# EAGLE design driver (EAGLE 8.1.0)
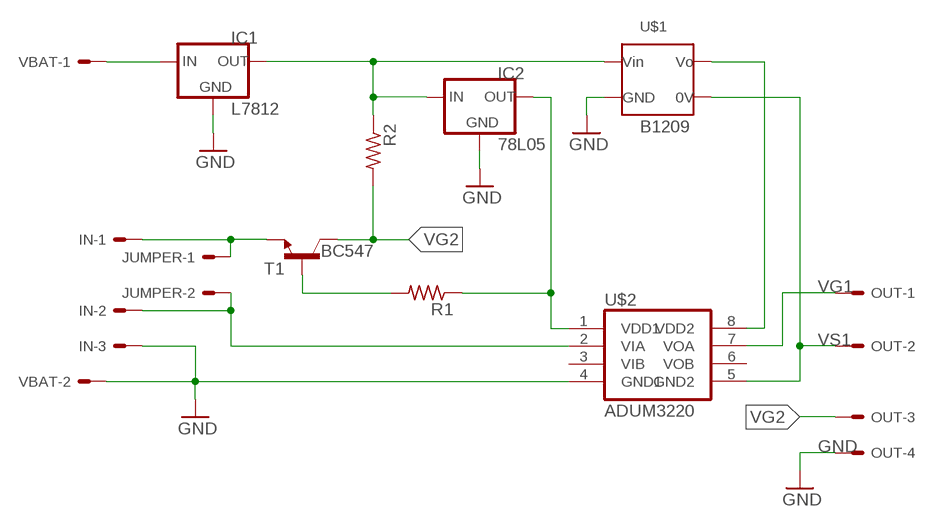
[diagram p0: schematic, sheet 1]

## Parts
IC1  L7812  78XXL  [78XXL]
IC2  78L05  78LXX  [78LXX]
IN  22-23-2031  [22-23-2031]
JUMPER  22-23-2021  [22-23-2021]
OUT  22-23-2041  [22-23-2041]
R1  R-US_0204/7  [0204/7]
R2  R-US_0204/7  [0204/7]
T1  BC547  [TO92]
U$1  B1209  [22-23-2041]
U$2  ADUM3220  [SO8]
VBAT  22-23-2021  [22-23-2021]

## Nets
GND: IC1.GND IC2.GND IN.3 OUT.4 U$1.1(GND) U$2.4(GND1) VBAT.2
N$1: IC1.OUT IC2.IN R2.1 U$1.2(VIN)
N$2: IC2.OUT R1.1 U$2.1(VDD1)
N$4: R1.2 T1.2(B)
N$5: IC1.IN VBAT.1
N$6: IN.2 JUMPER.2 U$2.2(VIA)
N$7: IN.1 JUMPER.1 T1.1(E)
VDD2: U$1.4(VO) U$2.8(VDD2)
VG1: OUT.1 U$2.7(VOA)
VG2: OUT.3 R2.2 T1.3(C)
VS1: OUT.2 U$1.3(0V) U$2.5(GND2)
Unconnected: U$2.3(VIB) U$2.6(VOB)

## Library data of the parts
IC1 = v-reg:78XXL: VOLTAGE REGULATOR
IC2 = v-reg:78LXX: VOLTAGE REGULATOR
IN = con-molex:22-23-2031: .100" (2.54mm) Center Header - 3 Pin; MF: MOLEX; MPN: 22-23-2031; OC_FARNELL: 1462950; OC_NEWARK: 30C0862
JUMPER VBAT = con-molex:22-23-2021: .100" (2.54mm) Center Header - 2 Pin; MF: MOLEX; MPN: 22-23-2021; OC_FARNELL: 1462926; OC_NEWARK: 25C3832
OUT = con-molex:22-23-2041: .100" (2.54mm) Center Header - 4 Pin; MF: MOLEX; MPN: 22-23-2041; OC_FARNELL: 1462920; OC_NEWARK: 38C0355
R1 R2 = resistor:R-US_: RESISTOR, American symbol
T1 = transistor:BC547: NPN TRANSISTOR
U$1 = felippe:B1209
U$2 = felippe:ADUM3220

## Board
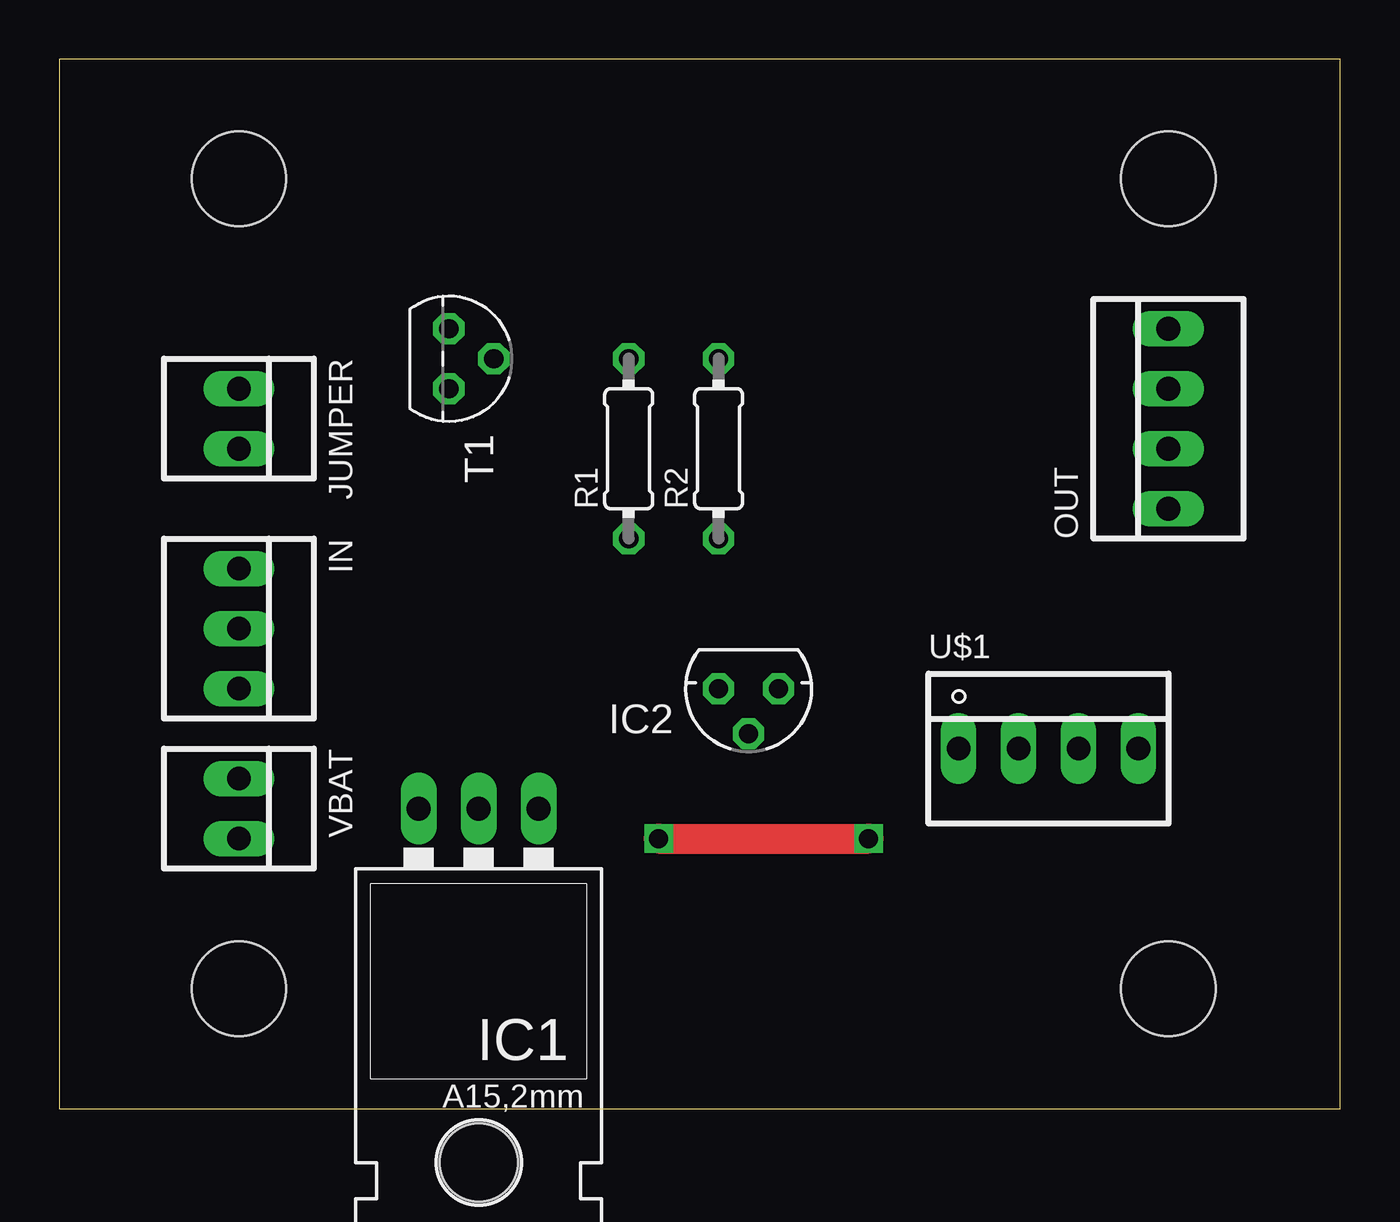
[diagram p1: board, top side]
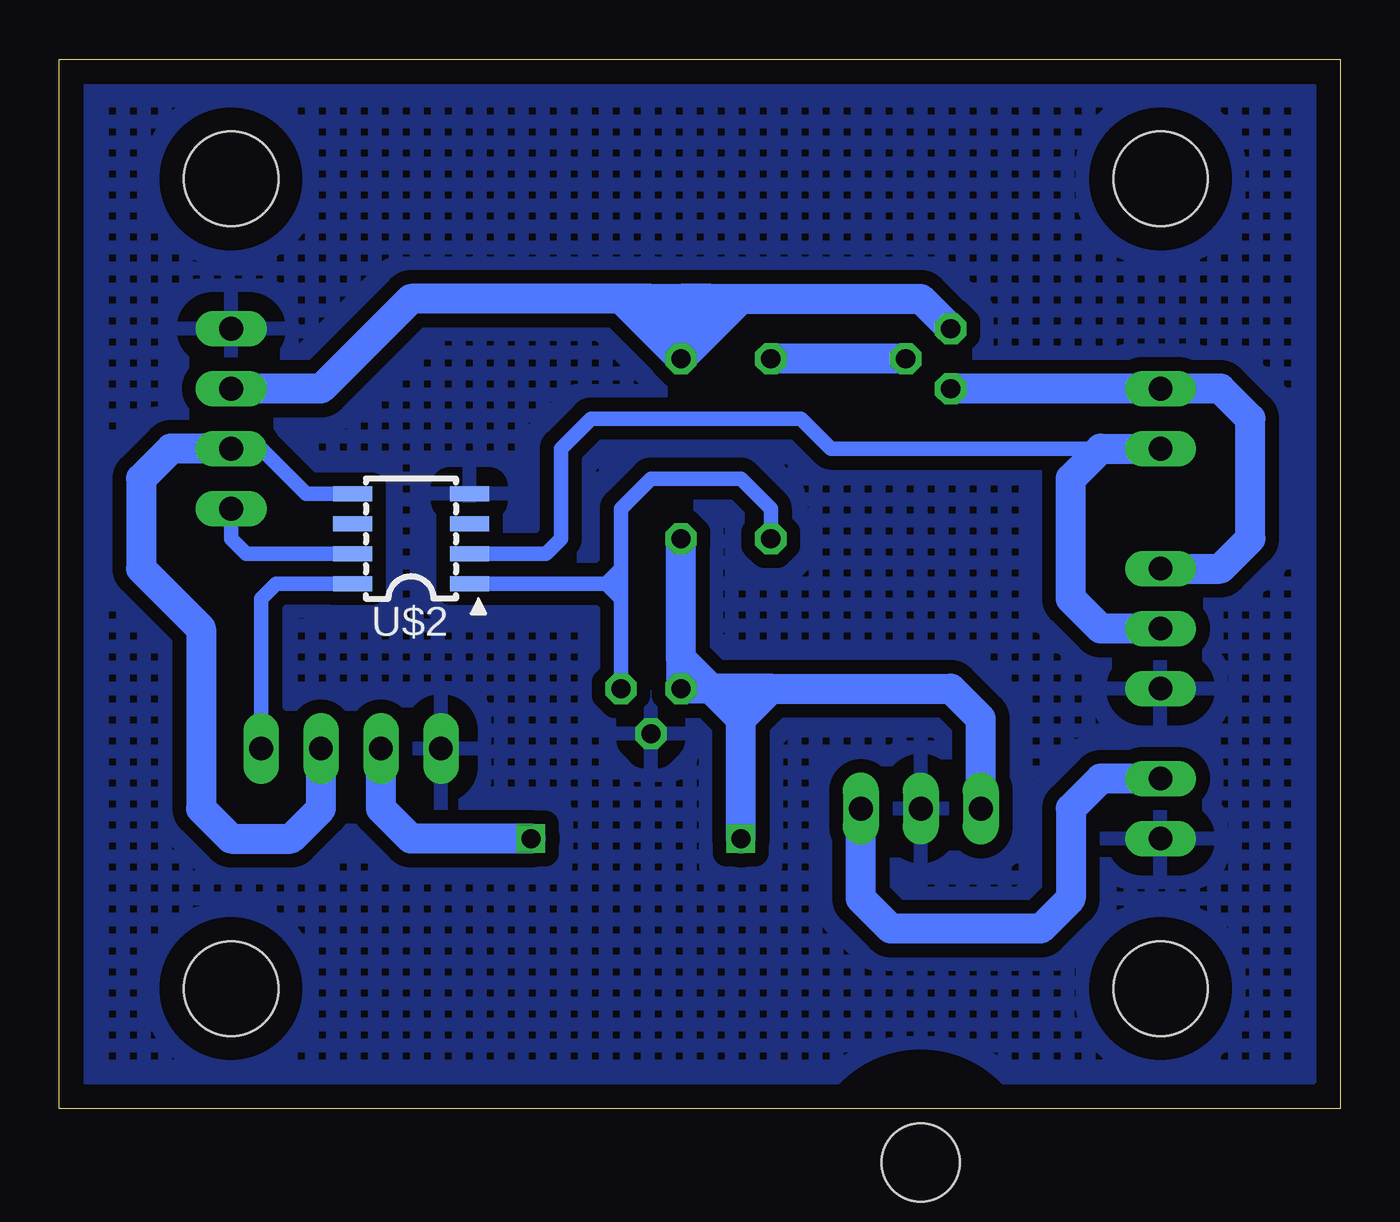
[diagram p2: board, bottom side, seen from below]

Size 54.28 x 44.44 mm. Coordinates in mm from the lower left corner, seen from the top.
Outline: 0,0 54.28,0 54.28,44.44 0,44.44 0,0
Copper layers (1*16): Top 0.035mm / dielectric 1.5mm / Bottom 0.035mm
Design rules "fresa": minimum track width 0.8mm, minimum drill 0.8mm, track to track 0.4mm, track to pad 0.4mm, pad to pad 0.4mm, via to via 0.4mm, smd to smd 6mil, copper to edge 40mil, drill to drill 8mil, minimum pad ring 10mil, minimum via ring 8mil, stop-mask expansion 4mil, vias tented up to drill 0mil, thermal gap 0.8mm
Holes 4 mm at 7.62,39.37 7.62,5.08 46.99,5.08 46.99,39.37

### Footprints (pad centres in the part's own frame; a part is rotated, then mirrored left to right if it is on the bottom)
78XXL = drill 1.016 long: GND 0,-3.81; IN -2.54,-3.81; OUT 2.54,-3.81 | hole 3.302: 0,11.176
78LXX = drill 0.813 octagon: GND 0,1.905; IN 1.27,0; OUT -1.27,0
22-23-2031 = drill 1 long: 1 -2.54,0; 2 0,0; 3 2.54,0
22-23-2021 = drill 1 long: 1 -1.27,0; 2 1.27,0
22-23-2041 = drill 1 long: 1 -3.81,0; 2 -1.27,0; 3 1.27,0; 4 3.81,0
0204/7 = drill 0.813 octagon: 1 -3.81,0; 2 3.81,0
TO92 = drill 0.813 octagon: 1 1.27,0; 2 0,1.905; 3 -1.27,0
SO8 = smd 0.635 x 1.651: 1 -1.905,-2.477; 2 -0.635,-2.477; 3 0.635,-2.477; 4 1.905,-2.477; 5 1.905,2.477; 6 0.635,2.477; 7 -0.635,2.477; 8 -1.905,2.477

### Placement (x,y rotation side)
IC1  17.78,8.89 180 top
IC2  29.21,17.78 180 top
IN  7.62,20.32 270 top
JUMPER  7.62,29.21 270 top
OUT  46.99,29.21 90 top
R1  24.13,27.94 90 top
R2  27.94,27.94 90 top
T1  16.51,31.75 270 top
U$1  41.91,15.24 0 top
U$2  39.37,24.13 90 bottom
VBAT  7.62,12.7 270 top

### Tracks (layer width: path | path; a pad name or v marks a point on that pad's centre or on a via)
GND
  pour Bottom (isolate 0.584, hatched): 1.27,1.27 1.27,43.18 53.34,43.18 53.34,1.27
N$1  (via drill 0.8)
  Top 1.27: v25.4,11.43 v34.29,11.43
  Bottom 1.27: IC1.OUT 15.24,16.51 16.51,17.78 24.13,17.78 | 25.4,17.78 26.67,17.78 | 26.67,17.78 IC2.IN 27.94,19.05 | 24.13,17.78 25.4,17.78 | 27.94,19.05 R2.1 | v34.29,11.43 39.37,11.43 40.64,12.7 U$1.2 | v25.4,11.43 25.4,16.51 | 25.4,16.51 25.4,17.78 | 25.4,16.51 24.13,17.78 | 25.4,16.51 26.67,17.78 | 26.67,17.78 27.94,19.05
N$2
  Bottom 0.61: R1.1 24.13,25.4 25.4,26.67 29.21,26.67 30.48,25.4 30.48,22.86 | 30.48,22.86 30.48,21.59 | 30.48,21.59 IC2.OUT | U$2.1 31.11,22.23 | 31.11,22.23 30.48,21.59 | 31.11,22.23 30.48,22.86
N$4
  Bottom 1.27: T1.2 R1.2
N$5
  Bottom 1.27: VBAT.1 10.16,13.97 11.43,12.7 11.43,8.89 12.7,7.62 19.05,7.62 20.32,8.89 IC1.IN
N$6
  Bottom 0.61: 10.16,27.94 21.59,27.94 22.86,29.21 30.48,29.21 31.75,29.21 33.02,27.94 33.02,24.13 33.66,23.5 U$2.2
  Bottom 1.27: IN.2 10.16,20.32 11.43,21.59 11.43,26.67 10.16,27.94 JUMPER.2
N$7
  Bottom 1.27: IN.1 5.08,22.86 3.81,24.13 3.81,29.21 5.08,30.48 JUMPER.1 T1.1
VDD2
  Bottom 0.61: U$2.8 45.09,22.23 45.72,21.59 U$1.4
VG1
  Bottom 0.61: U$2.7 46.35,23.5 46.99,24.13 OUT.1
VG2
  Bottom 1.27: T1.3 17.78,34.29 25.4,34.29 | 26.67,34.29 25.4,34.29 | 26.67,34.29 27.94,34.29 | 29.21,34.29 30.48,34.29 | 29.21,34.29 27.94,34.29 | 27.94,34.29 27.94,33.02 | 27.94,33.02 R2.2 | R2.2 30.48,34.29 | R2.2 25.4,34.29 | 27.94,33.02 26.67,34.29 | 27.94,33.02 29.21,34.29 | 30.48,34.29 39.37,34.29 43.18,30.48 OUT.3
VS1
  Bottom 0.61: U$2.5 43.81,26.04 45.72,27.94 OUT.2
  Bottom 1.27: OUT.2 49.53,27.94 50.8,26.67 50.8,22.86 48.26,20.32 48.26,12.7 46.99,11.43 44.45,11.43 43.18,12.7 U$1.3